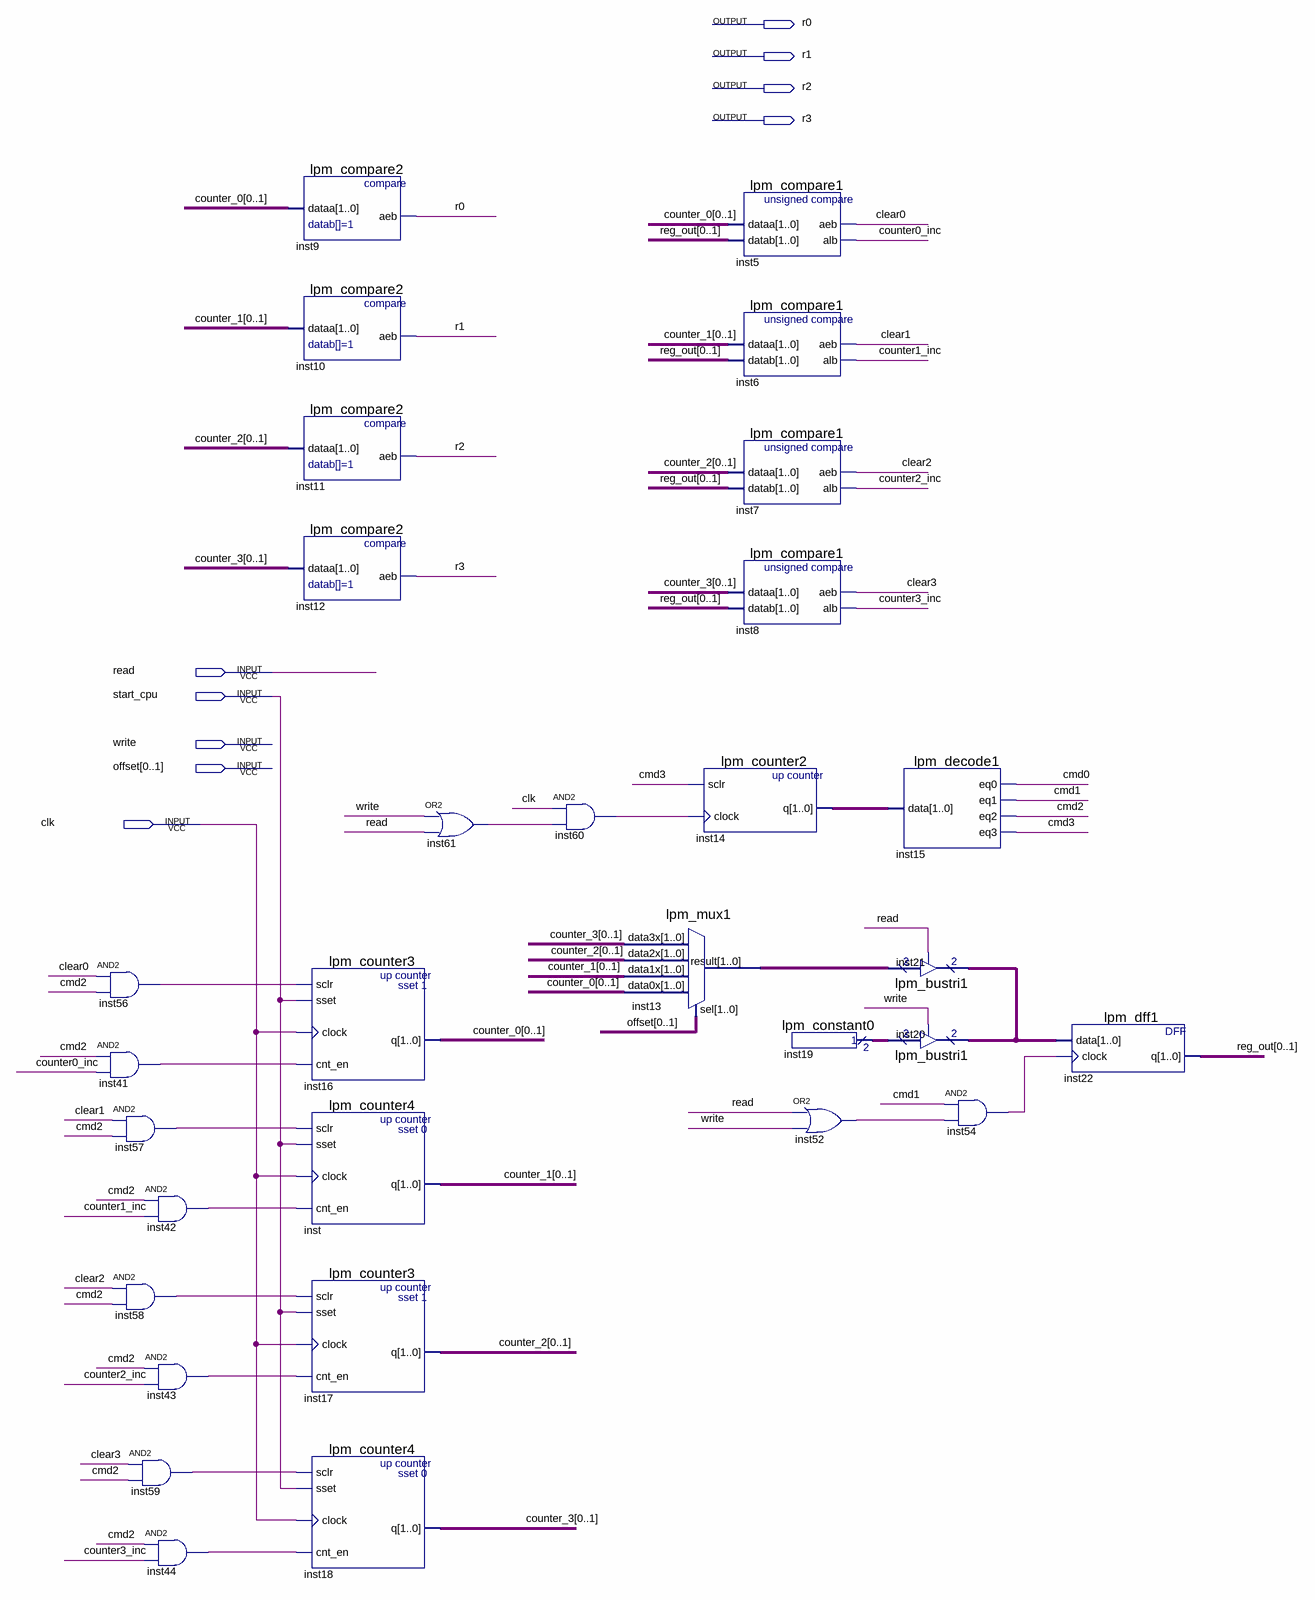
[diagram p0: schematic sheet]
// Quartus schematic LRU.bdf as structural Verilog: 31 symbols, 9 pins
module LRU (
  input  read,
  input  start_cpu,
  input  write,
  input  [0:1] offset,
  input  clk,
  output r0,
  output r1,
  output r2,
  output r3
);

  wire clear0, clear1, clear2, clear3, cmd0, cmd1, cmd2, cmd3, counter0_inc, counter1_inc, counter2_inc,
       counter3_inc, inst41_out, inst42_out, inst43_out, inst44_out, inst52_out, inst54_out, inst56_out,
       inst57_out, inst58_out, inst59_out, inst60_out, inst61_out;
  wire [1:0] counter_0, counter_1, counter_2, counter_3, inst13_result, inst14_q, inst19_result,
       inst21_tridata, reg_out;

  and inst56 (inst56_out, clear0, cmd2);
  and inst41 (inst41_out, cmd2, counter0_inc);
  and inst57 (inst57_out, clear1, cmd2);
  and inst42 (inst42_out, cmd2, counter1_inc);
  and inst58 (inst58_out, clear2, cmd2);
  and inst43 (inst43_out, cmd2, counter2_inc);
  and inst59 (inst59_out, clear3, cmd2);
  and inst44 (inst44_out, cmd2, counter3_inc);
  lpm_compare2 inst9 (.dataa({counter_0[0], counter_0[1]}), .aeb(r0));
  lpm_compare2 inst10 (.dataa({counter_1[0], counter_1[1]}), .aeb(r1));
  lpm_compare2 inst11 (.dataa({counter_2[0], counter_2[1]}), .aeb(r2));
  lpm_compare2 inst12 (.dataa({counter_3[0], counter_3[1]}), .aeb(r3));
  lpm_counter3 inst16 (
    .sclr(inst56_out), .sset(start_cpu), .clock(clk), .cnt_en(inst41_out), .q({counter_0[0], counter_0[1]}));
  lpm_counter4 inst (
    .sclr(inst57_out), .sset(start_cpu), .clock(clk), .cnt_en(inst42_out), .q({counter_1[0], counter_1[1]}));
  lpm_counter3 inst17 (
    .sclr(inst58_out), .sset(start_cpu), .clock(clk), .cnt_en(inst43_out), .q({counter_2[0], counter_2[1]}));
  lpm_counter4 inst18 (
    .sclr(inst59_out), .sset(start_cpu), .clock(clk), .cnt_en(inst44_out), .q({counter_3[0], counter_3[1]}));
  or inst61 (inst61_out, write, read);
  and inst60 (inst60_out, clk, inst61_out);
  lpm_mux1 inst13 (
    .data3x({counter_3[0], counter_3[1]}), .data2x({counter_2[0], counter_2[1]}),
    .data1x({counter_1[0], counter_1[1]}), .data0x({counter_0[0], counter_0[1]}), .sel(offset),
    .result(inst13_result));
  lpm_compare1 inst5 (
    .dataa({counter_0[0], counter_0[1]}), .datab({reg_out[0], reg_out[1]}), .aeb(clear0), .alb(counter0_inc));
  lpm_compare1 inst6 (
    .dataa({counter_1[0], counter_1[1]}), .datab({reg_out[0], reg_out[1]}), .aeb(clear1), .alb(counter1_inc));
  lpm_compare1 inst7 (
    .dataa({counter_2[0], counter_2[1]}), .datab({reg_out[0], reg_out[1]}), .aeb(clear2), .alb(counter2_inc));
  lpm_compare1 inst8 (
    .dataa({counter_3[0], counter_3[1]}), .datab({reg_out[0], reg_out[1]}), .aeb(clear3), .alb(counter3_inc));
  lpm_counter2 inst14 (.sclr(cmd3), .clock(inst60_out), .q(inst14_q));
  lpm_constant0 inst19 (.result(inst19_result));
  or inst52 (inst52_out, read, write);
  lpm_decode1 inst15 (.data(inst14_q), .eq0(cmd0), .eq1(cmd1), .eq2(cmd2), .eq3(cmd3));
  lpm_bustri1 inst21 (.enabledt(read), .data(inst13_result), .tridata(inst21_tridata));
  lpm_bustri1 inst20 (.enabledt(write), .data(inst19_result), .tridata(inst21_tridata));
  and inst54 (inst54_out, cmd1, inst52_out);
  lpm_dff1 inst22 (.data(inst21_tridata), .clock(inst54_out), .q({reg_out[0], reg_out[1]}));
endmodule
